# Altium schematic sheet Sheet1.SchDoc
size A; SheetNumber: 1; SheetTotal: 2
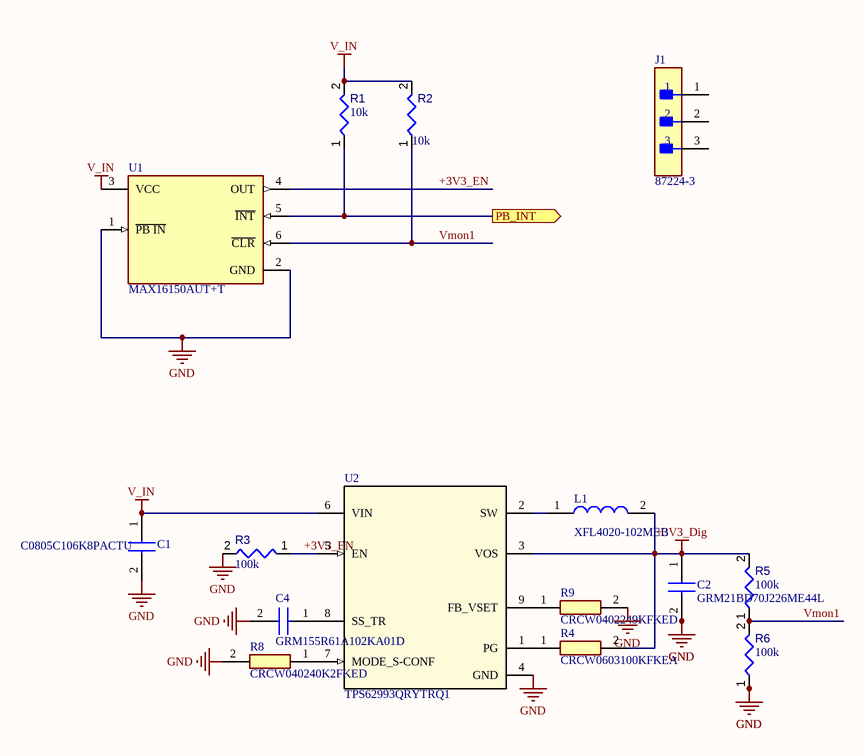
[diagram p0: Sheet1.SchDoc]

## Parts
C1  C0805C106K8PACTU  [C0805]
C2  GRM21BD70J226ME44L  [CAPC2012X145N]
C4  GRM155R61A102KA01D  [CAPC1005X55N]
J1  87224-3  [FP-87224-3-MFG]
L1  XFL4020-102MEB  [XFL4020102MEB]
R1  value 10k  [RESC0402(1005)_L]  (hidden comment: 10KR2F)
R2  value 10k  [RESC0402(1005)_L]  (hidden comment: 10KR2F)
R3  value 100k  [RESC0402(1005)_L]  (hidden comment: 100KR2F)
R4  CRCW0603100KFKEA  [RESC1608X50N]
R5  value 100k  [RESC0402(1005)_L]  (hidden comment: 100KR2F)
R6  value 100k  [RESC0402(1005)_L]  (hidden comment: 100KR2F)
R8  CRCW040240K2FKED  [RESC1005X40N]
R9  CRCW0402249KFKED  [RESC1005X40N]
U1  MAX16150AUT+T  [FP-U6-1-MFG]
U2  TPS62993QRYTRQ1  [RYT0009A-MFG]

## Ports
PB_INT (out)

## Nets
+3V3_Dig: C2.1 L1.2 R4.2 R5.2 U2.3(VOS)
GND: C1.2 C2.2 C4.2 R3.2 R6.1 R8.2 R9.2 U1.1(~{PB_IN}) U1.2(GND) U2.4(GND)
V_IN: C1.1 R1.2 R2.2 U1.3(VCC) U2.6(VIN)
+3V3_EN: R3.1 U1.4(OUT) U2.5(EN)
PB_INT: R1.1 U1.5(~{INT}) ; port PB_INT
Vmon1: R2.1 R5.1 R6.2 U1.6(~{CLR})
NetC4_1: C4.1 U2.8(SS_TR)
NetL1_1: L1.1 U2.2(SW)
NetR4_1: R4.1 U2.1(PG)
NetR8_1: R8.1 U2.7(MODE_S-CONF)
NetR9_1: R9.1 U2.9(FB_VSET)

Not connected (* = marked no-connect by the designer): J1 1 2 3

## Library data of the parts
C1 = C0805C106K8PACTU: Capacitor; Manufacturer_Name: KEMET; Datasheet Link: https://content.kemet.com/datasheets/KEM_C1006_X5R_SMD.pdf; Height: 1.1mm; Manufacturer_Part_Number: C0805C106K8PACTU; Mouser Part Number: 80-C0805C106K8P; Mouser Price/Stock: https://www.mouser.co.uk/ProductDetail/KEMET/C0805C106K8PACTU?qs=Zpyg6gQUYs39C21BeavaKA%3D%3D; Arrow Part Number: C0805C106K8PACTU; Arrow Price/Stock: https://www.arrow.com/en/products/c0805c106k8pactu/kemet-corporation?region=nac
C2 = GRM21BD70J226ME44L: Capacitor; Manufacturer_Name: Murata Electronics; Datasheet Link: http://www.murata.com/~/media/webrenewal/support/library/catalog/products/capacitor/mlcc/c02e.pdf; Height: 1.45mm; Manufacturer_Part_Number: GRM21BD70J226ME44L; Mouser Part Number: 81-GRM21BD70J226ME4L; Mouser Price/Stock: https://www.mouser.co.uk/ProductDetail/Murata-Electronics/GRM21BD70J226ME44L?qs=hNud%2FORuBR06AS6H25issw%3D%3D; Arrow Part Number: GRM21BD70J226ME44L; Arrow Price/Stock: https://www.arrow.com/en/products/grm21bd70j226me44l/murata-manufacturing?region=nac
C4 = GRM155R61A102KA01D: Capacitor; Manufacturer_Name: Murata Electronics; Datasheet Link: http://www.murata.com/~/media/webrenewal/support/library/catalog/products/capacitor/mlcc/c02e.pdf; Height: 0.55mm; Manufacturer_Part_Number: GRM155R61A102KA01D; Mouser Part Number: 81-GRM155R61A102KA1D; Mouser Price/Stock: https://www.mouser.co.uk/ProductDetail/Murata-Electronics/GRM155R61A102KA01D?qs=y02iAgv9n635dgph15ru9A%3D%3D; Arrow Part Number: GRM155R61A102KA01D; Arrow Price/Stock: https://www.arrow.com/en/products/grm155r61a102ka01d/murata-manufacturing?region=nac
J1 = CMP-2000-05697-2: CONN HEADER VERT 3POS 2.54MM; Number of Positions: 3; Gasket: No (Without); High Speed Serial Data Connector: No; Current Rating: 3A; Contact Post Length: 0.125inch; PCB Thickness: 1.397mm; PCB Mount Retention: Without; Connector Type: Plug; Approvals: CSA; PCB Mounting Orientation: Vertical; Pitch: 2.54mm; Mating Alignment: No (Without); Housing Color: Black; Contact Gender: Male; Length: 7.21mm; Max Operating Temperature: 105°C; Strain Relief: No (Without); Contact Material: Bronze; Row Spacing: 2.54mm; Series: AMPMODU MOD II; Board Standoff: No (Without); Package Quantity: 520; Radiation Hardening: No; Contact Protection: No (Without); Stabilizers: No (Without); Number of Rows: 1; Contact Mating Length: 8.08mm; Contact Shape: Square; Depth: 2.54mm; Contact Current Rating: 3A; Flammability Rating: UL94 V-0; Packaging: Carton; Number of Contacts: 3; Orientation: Straight; Mount: Through Hole; Keyed: No; Contact Type: Male Pin; Housing Material: Thermoplastic; High Temperature Housing: No; ELV: Compliant; Contact Plating: Gold; Termination: Through Hole; Selectively Loaded: No (Without); Lead Free: Lead Free; Min Operating Temperature: -65°C; Mating Connector Lock: No (Without); Color: Black; RoHS Compliant: Yes
L1 = XFL4020-102MEB: Inductor; Manufacturer_Name: COILCRAFT; Datasheet Link: https://www.coilcraft.com/getmedia/50632d43-da1b-4cdb-8ab4-3029cab51df3/xfl4020.pdf; Height: 2.1mm; Manufacturer_Part_Number: XFL4020-102MEB; Mouser Part Number: 994-XFL4020-102MEB; Mouser Price/Stock: https://www.mouser.co.uk/ProductDetail/Coilcraft/XFL4020-102MEB?qs=VJjuEbE9QBMkuCkoKl%252B%2FQw%3D%3D
R1 R2 = CMP-009-00066-2: 10K 0.063W 1% 0402 (1005 Metric)  SMD; Power: 63mW; Case/Package: 0402; Mounting Technology: SMT; Pins: 2; Tolerance: 1%
R3 R5 R6 = CMP-009-00064-2: 100K 0.063W 1% 0402 (1005 Metric)  SMD; Power: 63mW; Case/Package: 0402; Mounting Technology: SMT; Pins: 2; Tolerance: 1%
R4 = CRCW0603100KFKEA: Resistor; Manufacturer_Name: Vishay; Datasheet Link: http://www.vishay.com/docs/20035/dcrcwe3.pdf; Height: 0.5mm; Manufacturer_Part_Number: CRCW0603100KFKEA; Mouser Part Number: 71-CRCW0603-100K-E3; Mouser Price/Stock: https://www.mouser.co.uk/ProductDetail/Vishay-Dale/CRCW0603100KFKEA?qs=6dqgS%252BKntICWHMMdIzt5%2FQ%3D%3D; Arrow Part Number: CRCW0603100KFKEA; Arrow Price/Stock: https://www.arrow.com/en/products/crcw0603100kfkea/vishay?region=nac
R8 = CRCW040240K2FKED: Resistor; Manufacturer_Name: Vishay; Datasheet Link: http://www.vishay.com/docs/20035/dcrcwe3.pdf; Height: 0.4mm; Manufacturer_Part_Number: CRCW040240K2FKED; Mouser Part Number: 71-CRCW0402-40.2K-E3; Mouser Price/Stock: https://www.mouser.co.uk/ProductDetail/Vishay-Dale/CRCW040240K2FKED?qs=rzhQWu8UUS3g49JmcwYN7w%3D%3D; Arrow Part Number: CRCW040240K2FKED; Arrow Price/Stock: https://www.arrow.com/en/products/crcw040240k2fked/vishay?region=nac
R9 = CRCW0402249KFKED: Resistor; Manufacturer_Name: Vishay; Datasheet Link: http://www.vishay.com/docs/20035/dcrcwe3.pdf; Height: 0.4mm; Manufacturer_Part_Number: CRCW0402249KFKED; Mouser Part Number: 71-CRCW0402-249K-E3; Mouser Price/Stock: https://www.mouser.co.uk/ProductDetail/Vishay-Dale/CRCW0402249KFKED?qs=oYI6rOI5zkt5STCnMCElTw%3D%3D; Arrow Part Number: CRCW0402249KFKED; Arrow Price/Stock: https://www.arrow.com/en/products/crcw0402249kfked/vishay?region=nac
U1 = CMP-05723-001129-1: IC SUPERVISOR 1 CHANNEL SOT23-6
U2 = TPS62993QRYTRQ1: No Description Available; Mfr_Name: Texas Instruments; Type: DEV; RefDes: RefDes; Copyright: Copyright (C) 2023 Ultra Librarian. All rights reserved.; Manufacturer_Part_Number: TPS62993QRYTRQ1